# EAGLE design Adafruit Qualia S3 RGB666 (EAGLE 9.6.2)
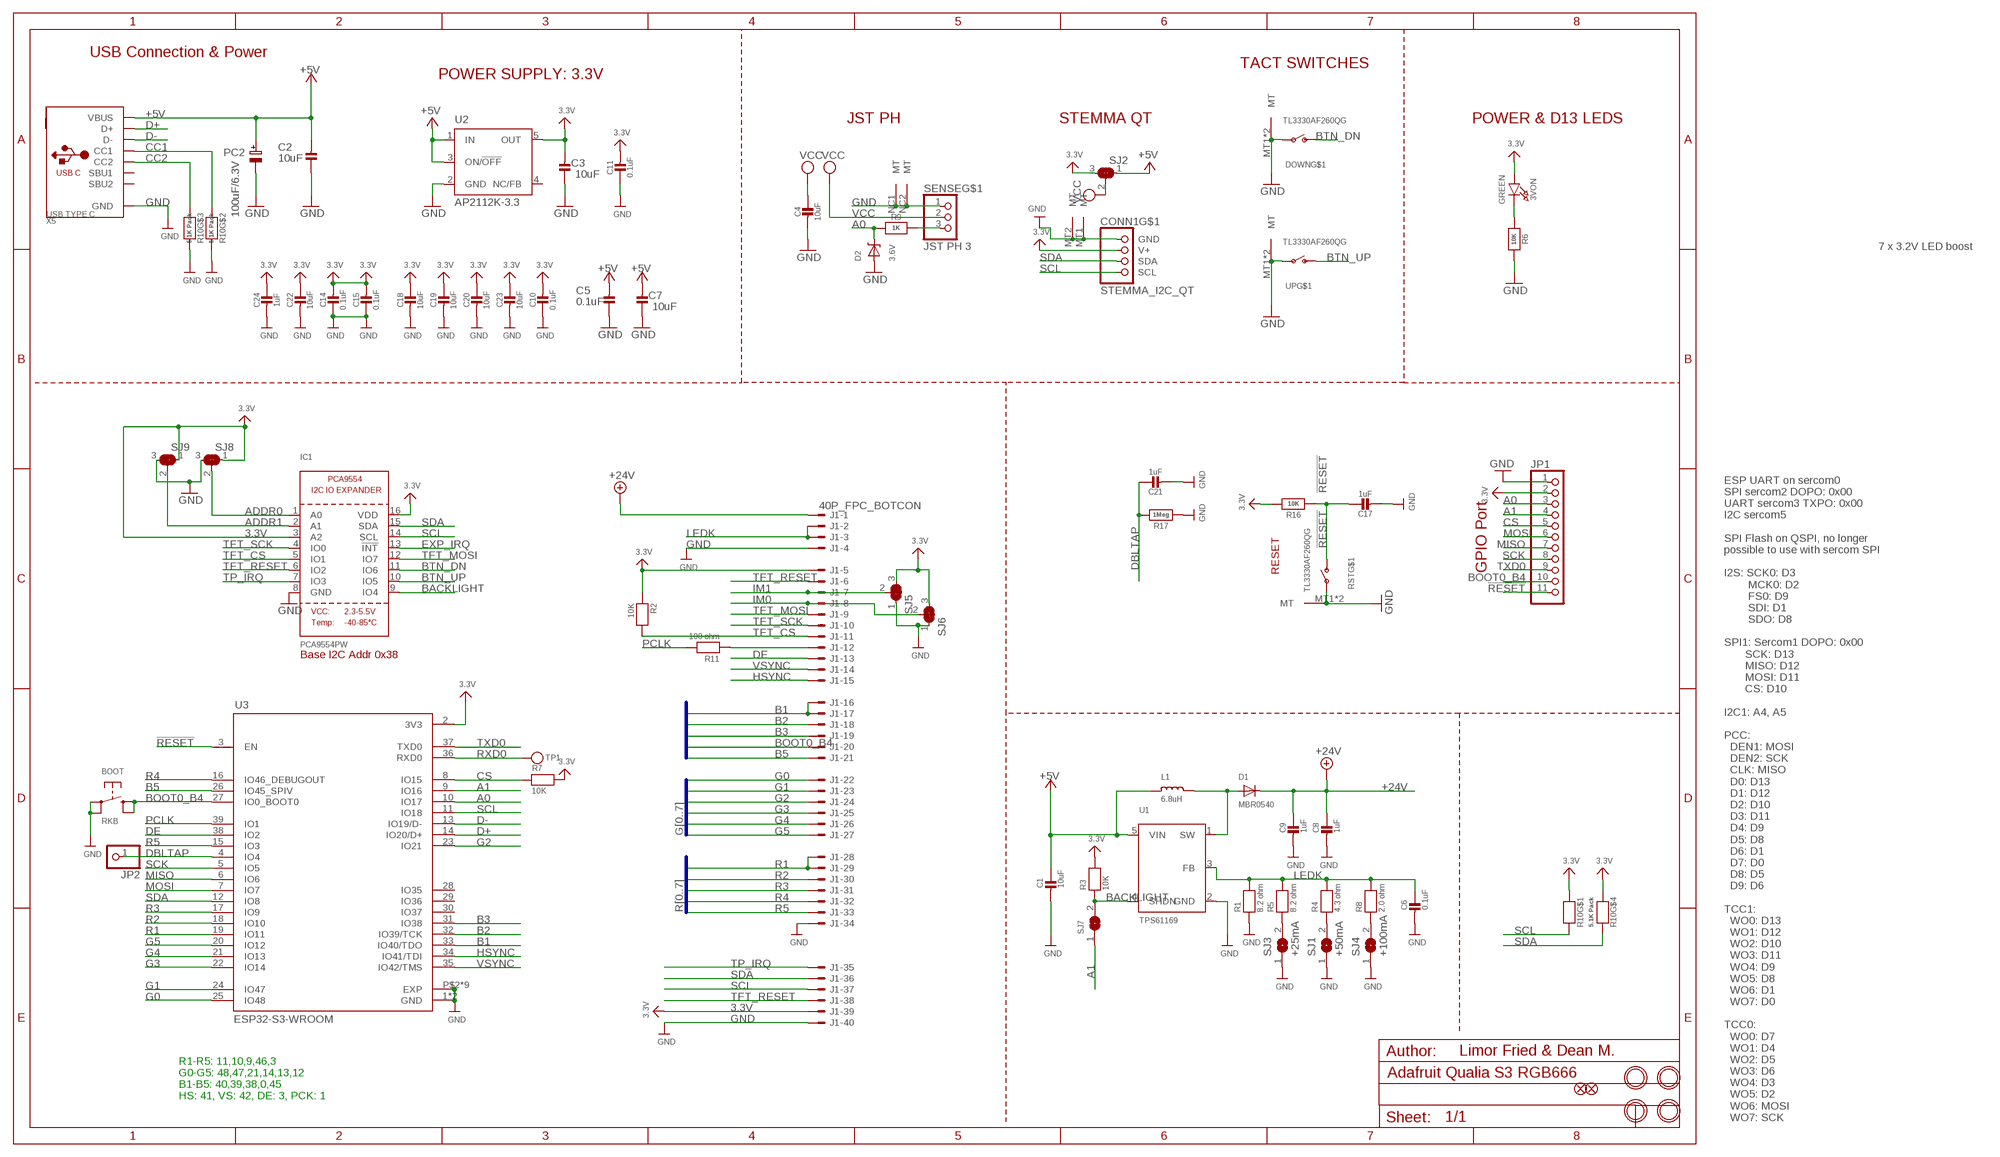
[diagram p0: schematic, sheet 1]

## Parts
3VON  GREEN  LED0603_NOOUTLINE  [CHIPLED_0603_NOOUTLINE]
BOOT  RKB  SWITCH_TACT_SMT_RKB2  [BTN_RKB2_4.6X2.8]
C1  10uF  CAP_CERAMIC0805-NOOUTLINE  [0805-NO]
C2  10uF  CAP_CERAMIC0805-NOOUTLINE  [0805-NO]
C3  10uF  CAP_CERAMIC0805-NOOUTLINE  [0805-NO]
C4  10uF  CAP_CERAMIC0805-NOOUTLINE  [0805-NO]
C5  0.1uF  CAP_CERAMIC0603_NO  [0603-NO]
C6  0.1uF  CAP_CERAMIC0603_NO  [0603-NO]
C7  10uF  CAP_CERAMIC0805-NOOUTLINE  [0805-NO]
C8  1uF  CAP_CERAMIC0603_NO  [0603-NO]
C9  1uF  CAP_CERAMIC0603_NO  [0603-NO]
C10  0.1uF  CAP_CERAMIC0603_NO  [0603-NO]
C11  0.1uF  CAP_CERAMIC0603_NO  [0603-NO]
C14  0.1uF  CAP_CERAMIC0603_NO  [0603-NO]
C15  0.1uF  CAP_CERAMIC0603_NO  [0603-NO]
C17  1uF  CAP_CERAMIC0603_NO  [0603-NO]
C18  10uF  CAP_CERAMIC0805-NOOUTLINE  [0805-NO]
C19  10uF  CAP_CERAMIC0805-NOOUTLINE  [0805-NO]
C20  10uF  CAP_CERAMIC0805-NOOUTLINE  [0805-NO]
C21  1uF  CAP_CERAMIC0603_NO  [0603-NO]
C22  10uF  CAP_CERAMIC0805-NOOUTLINE  [0805-NO]
C23  10uF  CAP_CERAMIC0805-NOOUTLINE  [0805-NO]
C24  1uF  CAP_CERAMIC0603_NO  [0603-NO]
CONN1  STEMMA_I2C_QT  [JST_SH4]
D1  MBR0540  DIODESOD-123  [SOD-123]
D2  3.6V  DIODE-ZENERSOD323  [SOD-323]
DOWN  TL3330AF260QG  SWITCH_SPST_MNT_TACT_RA  [SPST_TACTILE_RA]
FID1  FIDUCIAL_1MM  [FIDUCIAL_1MM]
FID2  FIDUCIAL_1MM  [FIDUCIAL_1MM]
IC1  PCA9554PW  [TSSOP16]
J1  40P_FPC_BOTCON  40PINFPC_GENERIC  [FPC_40]
JP1  HEADER-1X11  [1X11_ROUND]
JP2  HEADER-1X1ROUND  [1X01_ROUND]
L1  6.8uH  INDUCTORNR5040  [INDUCTOR_5X5MM_NR5040_NOTHERMALS]
PC2  100uF/6.3V  CAP_ELECTROLYTICPANASONIC_D  [PANASONIC_D]
R1  8.2 ohm  RESISTOR_0603_NOOUT  [0603-NO]
R2  10K  RESISTOR_0603_NOOUT  [0603-NO]
R3  10K  RESISTOR_0603_NOOUT  [0603-NO]
R4  4.3 ohm  RESISTOR_0603_NOOUT  [0603-NO]
R5  8.2 ohm  RESISTOR_0603_NOOUT  [0603-NO]
R6  10K  RESISTOR_0603_NOOUT  [0603-NO]
R7  10K  RESISTOR_0603_NOOUT  [0603-NO]
R8  2.0 ohm  RESISTOR_0603_NOOUT  [0603-NO]
R9  1K  RESISTOR_0603_NOOUT  [0603-NO]
R10  5.1K Pack  RESISTOR_4PACK  [RESPACK_4X0603]
R11  100 ohm  RESISTOR_0603_NOOUT  [0603-NO]
R16  10K  RESISTOR_0603_NOOUT  [0603-NO]
R17  1Meg  RESISTOR_0603_NOOUT  [0603-NO]
RST  TL3330AF260QG  SWITCH_SPST_MNT_TACT_RA  [SPST_TACTILE_RA]
SENSE  JST PH 3  CON_JST_PH_3PIN  [JSTPH3]
SJ1  +50mA  SOLDERJUMPER  [SOLDERJUMPER_ARROW_NOPASTE]
SJ2  SOLDERJUMPER_2WAY  [SOLDERJUMPER_2WAY_OPEN_NOPASTE]
SJ3  +25mA  SOLDERJUMPER  [SOLDERJUMPER_ARROW_NOPASTE]
SJ4  +100mA  SOLDERJUMPER  [SOLDERJUMPER_ARROW_NOPASTE]
SJ5  SOLDERJUMPER_2WAY  [SOLDERJUMPER_2WAY_OPEN_NOPASTE]
SJ6  SOLDERJUMPER_2WAY  [SOLDERJUMPER_2WAY_OPEN_NOPASTE]
SJ7  SOLDERJUMPER  [SOLDERJUMPER_ARROW_NOPASTE]
SJ8  SOLDERJUMPER_2WAY  [SOLDERJUMPER_2WAY_OPEN_NOPASTE]
SJ9  SOLDERJUMPER_2WAY  [SOLDERJUMPER_2WAY_OPEN_NOPASTE]
TP1  TESTPOINTROUND1.5MMNO  [TESTPOINT_ROUND_1.5MM_NO]
U1  TPS61169  VREG_BOOST_5PIN_SC70  [SC70-5]
U2  AP2112K-3.3  LP2985-XXDBVR33  [SOT23-DBV]
U3  ESP32-S3-WROOM  [S3-WROOM32]
U$14  MOUNTINGHOLE2.5  [MOUNTINGHOLE_2.5_PLATED]
U$19  MOUNTINGHOLE2.5  [MOUNTINGHOLE_2.5_PLATED]
U$22  MOUNTINGHOLE2.5  [MOUNTINGHOLE_2.5_PLATED]
U$24  MOUNTINGHOLE2.5  [MOUNTINGHOLE_2.5_PLATED]
UP  TL3330AF260QG  SWITCH_SPST_MNT_TACT_RA  [SPST_TACTILE_RA]
X5  USB TYPE C  USB_C  [USB_C_CUSB31-CFM2AX-01-X]

## Nets
3.3V: 3VON.A C3.2 C10.2 C11.2 C14.2 C15.2 C18.1 C19.1 C20.1 C22.1 C23.1 C24.1 CONN1.2(V+) IC1.3(A2) IC1.16(VDD) J1.5 J1.39 JP1.2 R2.1 R3.2 R7.2 R10.1 R10.4 R16.2 SJ2.3 SJ5.3 SJ6.3 SJ8.1 SJ9.1 U2.5(OUT) U3.2(3V3)
!RESET: C17.1 JP1.11 R16.1 RST.2(S) U3.3(EN)
+5V [usbvcc]: C1.1 C2.2 C5.2 C7.2 L1.P$1 PC2.+ SJ2.1 U1.5(VIN) U2.1(IN) U2.3(ON/!OFF) X5.A4B9(VBUS) X5.B4A9(VBUS)
+24V: C8.1 C9.1 D1.C J1.1
A0: D2.C JP1.3 R9.2 U3.10(IO17)
A0_JST: R9.1 SENSE.3
A1: JP1.4 SJ7.1 U3.9(IO16)
ADDR0: IC1.1(A0) SJ8.2
ADDR1: IC1.2(A1) SJ9.2
B1: J1.16 J1.17 U3.33(IO40/TDO)
B2: J1.18 U3.32(IO39/TCK)
B3: J1.19 U3.31(IO38)
B5: J1.21 U3.26(IO45_SPIV)
BACKLIGHT: IC1.9(IO4) R3.1 SJ7.2 U1.4(SHDN)
BOOT0_B4: BOOT.B'(S1) BOOT.B(S) J1.20 JP1.10 U3.27(IO0_BOOT0)
BTN_DN: DOWN.2(S) IC1.11(IO6)
BTN_UP: IC1.10(IO5) UP.2(S)
CC1: R10.2 X5.A5(CC1)
CC2: R10.3 X5.B5(CC2)
CS: JP1.5 R7.1 U3.8(IO15)
D+: U3.14(IO20/D+) X5.A6(D+) X5.B6(D+)
D-: U3.13(IO19/D-) X5.A7(D-) X5.B7(D-)
DBLTAP: C21.1 JP2.1 R17.2 U3.4(IO4)
DE: J1.13 U3.38(IO2)
EXP_IRQ: IC1.13(!INT)
G0: J1.22 U3.25(IO48)
G1: J1.23 U3.24(IO47)
G2: J1.24 U3.23(IO21)
G3: J1.25 U3.22(IO14)
G4: J1.26 U3.21(IO13)
G5: J1.27 U3.20(IO12)
GND [lowpower]: BOOT.A'(P1) BOOT.A(P) C1.2 C2.1 C3.1 C4.2 C5.1 C6.2 C7.1 C8.2 C9.2 C10.1 C11.1 C14.1 C15.1 C17.2 C18.2 C19.2 C20.2 C21.2 C22.2 C23.2 C24.2 CONN1.1(GND) CONN1.MT1(MT) CONN1.MT2(MT) D2.A DOWN.1(P) DOWN.MT1(MT) DOWN.MT2(MT) IC1.8(GND) J1.4 J1.34 J1.40 JP1.1 PC2.- R1.1 R6.2 R10.6 R10.7 R17.1 RST.1(P) RST.MT1(MT) RST.MT2(MT) SENSE.1 SENSE.NC1(MT) SENSE.NC2(MT) SJ1.1 SJ3.1 SJ4.1 SJ5.1 SJ6.1 SJ8.3 SJ9.3 U1.2(GND) U2.2(GND) U3.1(GND) U3.40(GND) U3.P$2(EXP) U3.P$3(EXP) U3.P$4(EXP) U3.P$5(EXP) U3.P$6(EXP) U3.P$7(EXP) U3.P$8(EXP) U3.P$9(EXP) U3.P$10(EXP) UP.1(P) UP.MT1(MT) UP.MT2(MT) X5.A1B12(GND) X5.B1A12(GND)
HSYNC: J1.15 U3.34(IO41/TDI)
IM0: J1.8 SJ6.2
IM1: J1.7 SJ5.2
LEDK: C6.1 J1.2 J1.3 R1.2 R4.2 R5.2 R8.2 U1.3(FB)
MISO: JP1.7 U3.6(IO6)
MOSI: JP1.6 U3.7(IO7)
N$2: 3VON.C R6.1
N$3: R4.1 SJ1.2
N$4: J1.12 R11.1
N$5: D1.A L1.P$2 U1.1(SW)
N$7: R5.1 SJ3.2
N$8: R8.1 SJ4.2
PCLK: R11.2 U3.39(IO1)
R1: J1.28 J1.29 U3.19(IO11)
R2: J1.30 U3.18(IO10)
R3: J1.31 U3.17(IO9)
R4: J1.32 U3.16(IO46_DEBUGOUT)
R5: J1.33 U3.15(IO3)
RXD0: TP1.P$1 U3.36(RXD0)
SCK: JP1.8 U3.5(IO5)
SCL: CONN1.4(SCL) IC1.14(SCL) J1.37 R10.8 U3.11(IO18)
SDA: CONN1.3(SDA) IC1.15(SDA) J1.36 R10.5 U3.12(IO8)
TFT_CS: IC1.5(IO1) J1.11 R2.2
TFT_MOSI: IC1.12(IO7) J1.9
TFT_RESET: IC1.6(IO2) J1.6 J1.38
TFT_SCK: IC1.4(IO0) J1.10
TP_IRQ: IC1.7(IO3) J1.35
TXD0: JP1.9 U3.37(TXD0)
VCC [power]: C4.1 SENSE.2 SJ2.2
VSYNC: J1.14 U3.35(IO42/TMS)
Unconnected: U2.4(NC/FB) U3.28(IO35) U3.29(IO36) U3.30(IO37) X5.A8(SBU1) X5.B8(SBU2)

## Buses
R[0..7]
G[0..7]
B[0..7],BOOT0_B4

## Notes on the sheet
- USB Connection & Power
- TACT SWITCHES
- POWER SUPPLY: 3.3V
- JST PH | STEMMA QT | POWER & D13 LEDS
- 7 x 3.2V LED boost
- RESET | GPIO Port
- Base I2C Addr 0x38
- Limor Fried & Dean M.
- R1-R5: 11,10,9,46,3
  G0-G5: 48,47,21,14,13,12
  B1-B5: 40,39,38,0,45
  HS: 41, VS: 42, DE: 3, PCK: 1
- ESP UART on sercom0
  SPI sercom2 DOPO: 0x00
  UART sercom3 TXPO: 0x00
  I2C sercom5
  
  SPI Flash on QSPI, no longer
  possible to use with sercom SPI
  
  I2S: SCK0: D3
          MCK0: D2
          FS0: D9
          SDI: D1
          SDO: D8
  
  SPI1: Sercom1 DOPO: 0x00
         SCK: D13
         MISO: D12
         MOSI: D11
         CS: D10
  
  I2C1: A4, A5
  
  PCC:
    DEN1: MOSI
    DEN2: SCK
    CLK: MISO
    D0: D13
    D1: D12
    D2: D10
    D3: D11
    D4: D9
    D5: D8
    D6: D1
    D7: D0
    D8: D5
    D9: D6
  
  TCC1:
    WO0: D13
    WO1: D12
    WO2: D10
    WO3: D11
    WO4: D9
    WO5: D8
    WO6: D1
    WO7: D0
  
  TCC0:
    WO0: D7
    WO1: D4
    WO2: D5
    WO3: D6
    WO4: D3
    WO5: D2
    WO6: MOSI
    WO7: SCK

## Library data of the parts
3VON = microbuilder:LED: LED 0603 - 0603 Surface Mount Package 2mA: Green LED - Low Power (3.9mcd, 2ma, 1.7Vf) - Digikey: 475-2709-2-ND Orange LED - Low Power (9.8mcd, 2ma, 1.8Vf) - Digikey: 475-1194-2-ND Red LED - Low Power (5mcd, 2ma, 1.8Vf) - Digikey: 475-1195-2-ND Yellow LED - Low Power (7mcd, 2ma, 1.8Vf) - Digikey: 475-1196-2-ND 5mA: Blue LED - Low Power (17mcd, 5ma, 2.9Vf) - Digikey: LNJ937W8CRACT-ND 0805 - 0805 Surface Mount Package 2mA: Red LED (8.8mcd, 2mA, 1.8Vf, Clear) - Low Power [Digikey: 475-2510-1-ND] Green LED (5mcd, 2mA, 1.8Vf, Clear) - Low Power [Digikey: 475-2730-1-ND] Yellow LED (11.3mcd, 2mA, 1.8Vf, Clear) - Low Power [Digikey: 475-2555-1-ND] 20mA: Red LED (104mcd, 20mA, Diffused) - LS R976 [Digikey: 475-1278-6-ND] Red LED (12mcd, 20mA, 2.0Vf, Clear) - APT2012EC [Digikey: 754-1128-1-ND] Green LED (15mcd, 20mA, 2.2Vf, Clear) - APT2012GC [Digikey: 754-1131-1-ND] Orange LED (160mcd, 20mA, 2.1Vf, Clear) - APT2012SECK [Digikey: 754-1130-1-ND] 1206 - 1206 Surface Mount Package Green LED (26mcd, 20mA, Diffused) - LG N971 [Digikey: 475-1407-6-ND] Red LED (15mcd, 20mA, Diffused) - LH N974 [Digikey: 475-1416-6-ND] Cree - Cree High-Power Surface Mount LEDs XPEBWT-L1-0000-00D50 - White 111lm 350mA 2.9Vf 6200K 110° XTEAWT-00-0000-00000LEE3 - White 114lm 350mA 2.85Vf 5000K 115° Everlight - Everlight 45-21 Series Surface Mount LEDs 45-21/QK2C-B2832AC2CB2/2T - Warm White 2000mcd 20mA 3.25Vf 3050K 120° 45-21/LK2C-B38452C4CB2/2T - Nuetral White 2000mcd 20mA 3.25Vf 4150K 120° 45-21/LK2C-B50634C6CB2/2T - Cold White 2200mcd 20mA 3.25Vf 5650K 120° PLCC2 Reverse Mount LS T77K-J1L2-1-0-2-R18-Z - Red 11.25mcd 2mA 1.8Vf 630nm 120° LO T77K-L1M2-24-Z - Orange 19.6mcd 2mA 1.8Vf 606nm 120° LY T77K-K2M1-26-Z - Yellow 15.7mcd 2mA 1.8Vf 587nm 120°; ROT: 270
BOOT = adafruit_electromech:SWITCH_TACT_SMT: SMT Tact Switches RKB2 https://www.digikey.com/short/m027prz5
C1-C11 C14 C15 C17-C24 = microbuilder:CAP_CERAMIC: Ceramic Capacitors For new designs, use the packages preceded by an '_' character since they are more reliable: The following footprints should be used on most boards: _0402 - Standard footprint for regular board layouts _0603 - Standard footprint for regular board layouts _0805 - Standard footprint for regular board layouts _1206 - Standard footprint for regular board layouts For extremely tight-pitch boards where space is at a premium, the following 'micro-pitch' footprints can be used (smaller pads, no silkscreen outline, etc.): _0402MP - Micro-pitch footprint for very dense/compact boards _0603MP - Micro-pitch footprint for very dense/compact boards _0805MP - Micro-pitch footprint for very dense/compact boards _1206MP - Micro-pitch footprint for very dense/compact boards
CONN1 = adafruit_electromech:STEMMA_I2C; LCSC: C2845363
D1 = microbuilder:DIODE: Diode SMA Model Volts Amps Type Vf Ir Digikey # Notes SSA34-E3 40V 3A Schottky 480mV @ 3A 200uA @ 40V SSA34-E3/61TGITR-ND CDBA120-G 20V 1A Schottky 500mV @ 1A 500uA @ 20V 641-1014-6-ND REEL MBRA210 10V 2A Schottky 350mV @ 2A 700uA @ 10V MBRA210LT3 SOD-123 Model Volts Amps Type Vf Ir Order # Notes BAT54T1G 30V 200mA Schottky 800mV @ 200mA 2uA @ 25V BAT54T1GOSTR-ND B0530W 30V 500mA Schottky 430mV @ 500mA 130uA @ 30V B0530W-FDICT-ND REEL MBR120 20V 1A Schottky 340mV @ 1A MBR120VLSFT1GOSCT-ND SOD-323 Model Volts Amps Type Vf Ir Order # Notes PMEG2005EJ 20V 500mA Schottky 355mV @ 500mA 568-4110-1-ND ZLLS410 10V 570mA Schottky 380mV @ 570mA ZLLS410CT-ND 1N4148WS 75V 150mA Silicon/Simple 1V 1N4148WSFSCT-ND REEL SOD-523 Model Volts Amps Type Vf Ir Order # Notes BAT54XV2 30V 200mA Schottky 0.8V @ 100mA BAT54XV2CT-ND TB751S 30V 30mA Schottky RB751S-40TE61CT-ND SOT23-R/W (R = Solder Paste/Reflow Ovens, W = Hand-Soldering) Model Volts Amps Type Vf Ir Order # Notes BAT54FILM 40V 300mA Schottky 497-7162-1-ND POWERDI-5 Model Volts Amps Type Vf Ir Order # Notes PDS560 60V 5A Schottky 670mV @ 5A 150uA @ 60V PDS560DICT-ND
D2 = microbuilder:DIODE-ZENER: Zener Diode SMA: 30V 1W Zener Diode, 1.2Vf - Digikey: SMAZ30-FDICT-ND
DOWN RST UP = adafruit_electromech:SWITCH_SPST_MNT: Switch - SPST 4UCon 19192 (6.7x2.6mm SMT); LCSC: C778159
FID1 FID2 = microbuilder:FIDUCIAL: Fiducial Alignment Points Various fiducial points for machine vision alignment.; BOM: EXCLUDE
IC1 = microbuilder:PCA9554
J1 = adafruit_display:40PINFPC: OMRON FPC Connector Source : http://www.omron.com/ecb/products/pdf/fpc.pdf XF2M-4015-rev is good for connecting up 'PSP' SHARP LQ043 LCDs
JP1 = microbuilder:HEADER-1X11
JP2 = microbuilder:HEADER-1X1: PIN HEADER
L1 = microbuilder:INDUCTOR: Inductors 0603: 10nH Ceramic Inductor - microwire antenna/RF (Digikey: 712-1434-2-ND) 0805: 560nH Ceramic Inductor - RF (Digikey: 553-1047-1-ND) 270nH Ceramic Inductor - Q = 40@250MHz, +-5%, 1 Ohm DC Resistance (Digikey: 535-10506-2-ND) 1007 (2518 Metric) SMT: 10µH 10% 250mOhm 820mA 1007 Inductor (Digikey: 587-2189-1-ND) 22µH 10% 500mOhm 580mA 1007 Inductor (Digikey: 587-2190-1-ND) 47µH 10% 950mOhm 420mA 1007 Inductor (Digikey: 587-2191-1-ND) 47µH 5% 100mOhm 1A 1008 Inductor (Digikey: 732-1816-1-ND) 5.0x5.0mm (Taiyo Yuden NR5040 Series) 6.8µH 20% 2.3A 64mOhm Inductor (Digikey: 587-2374-2-ND) 5.0x5.0mm (TDK VLC5045 Series) 4.7µH 20% 3.3A 34mOhm Inductor (Digikey: 445-6526-1-ND) 6.8µH 20% 2.7A 46mOhm Inductor (Digikey: 445-6527-1-ND) 6.0x6.0mm (TDK VLC6045 Series) 4.7µH 20% 3.8A 27mOhm Inductor (Digikey: 445-6538-2-ND) 6.8µH 20% 3A 41mOhm Inductor (Digikey: 445-6540-1-ND) 6.2µH 30% 2.2A 45mOhm Inductor (Digikey: SRR5028-6R2YCT-ND) - Not TDK VLC6045 but footprint should match 6.0x6.0mm (TDK SLF6045 Series) 6.8uH 30% 2A 33mOhm Inductor (Digikey: 445-4572-1-ND, Mouser: 810-SLF645T6R8N2R0PF) 6.0x6.0mm (Sumida CDRH5D28 Series) 6.2uH 30% 1.8A 45mOhm Inductor (Digikey: 308-1542-1-ND) Taiyo Yuden NR3015T2R2M - 2.2uH 20% 1.5A (Digikey: 587-1648-2-ND, Mouser: 963-NR3015T2R2M) - Used with TI TPS62172 CoilCraft RFID Transponder Coil - MA5532-AE (For use with AS3935 Lightning Sensor) Taiyo Yuden NRH2412T2R2MNGH - 2.2uH 20% 1AA (Digikey: 587-3443-1-ND) - Used with TI LM3671 Vishay IHLP 1.0uH Molded Inductor - 24mOhm DCR, 5A, +/-20%, -55°C-125°C (Digikey: 541-1319-1-ND)
PC2 = microbuilder:CAP_ELECTROLYTIC: Electrolytic Capacitors SMT PANASONIC_C - Size C Panasonic Electrolytic Aluminum Capacitor 47µF 16V 20% Electrolytic Capacitor [Digikey: PCE3890TR-ND] PANASONIC_D - Size D Panasonic Electrolytic Aluminum Capacitor 100µF 25V 20% Electrolytic Capacitor [Digikey: PCE3898TR-ND] PTH 3.5 mm grid, 8 mm diameter ... 3.5 mm grid, 10 mm diameter ...
R1-R9 R11 R16 R17 = microbuilder:RESISTOR: Resistors For new designs, use the packages preceded by an '_' character since they are more reliable: The following footprints should be used on most boards: _0402 - Standard footprint for regular board layouts _0603 - Standard footprint for regular board layouts _0805 - Standard footprint for regular board layouts _1206 - Standard footprint for regular board layouts For extremely tight-pitch boards where space is at a premium, the following 'micro-pitch' footprints can be used (smaller pads, no silkscreen outline, etc.): _0402MP - Micro-pitch footprint for very dense/compact boards _0603MP - Micro-pitch footprint for very dense/compact boards _0805MP - Micro-pitch footprint for very dense/compact boards _1206MP - Micro-pitch footprint for very dense/compact boards
R10 = microbuilder:RESISTOR_4PACK: Resistor Packs (4 resistors) 4 x 0603 10K 1/16W - Digikey: YC164J-10KCT-ND
SENSE = adafruit_electromech:CON_JST_PH_3PIN
SJ1 SJ3 SJ4 SJ7 = microbuilder:SOLDERJUMPER: SMD Solder JUMPER Solder the two pads together to create a connection, or remove the solder to break it. REFLOW - Use this footprint for solder paste and reflow ovens. WAVE - Use this footprint for hand-soldering (larger pads). CLOSED - Has a trace between the two pads to ensure it is closed by default. The trace needs to be cut to disable the jumper, and can be closed again by creating a solder bridge between the two pads.; BOM: EXCLUDE
SJ2 SJ5 SJ6 SJ8 SJ9 = microbuilder:SOLDERJUMPER_2WAY: 2-Way Solder Jumper
TP1 = microbuilder:TESTPOINT: Test Point Various test points for characterisation and PCB testing TESTPOINT_SMT - Compact Surface Mount Test Point [Digikey: 5016KTR-ND]
U1 = adafruit_power:VREG_BOOST_5PIN: FAN5331 - LED/OLED 20V Boost Converter Digikey: FAN5331SXCT-ND
U2 = SmartPrj:LP2985-XXDBVR: ULTRALOW-POWER 50-mA LOW-DROPOUT LINEAR REGULATORS 50-mA Low-Dropout Regulator Source: http://focus.ti.com/lit/ds/symlink/tps77001.pdf
U3 = adafruit_wireless:ESP32-S3-WROOM: WiFi 802.11b/g/n Transceiver Module 2.4GHz Antenna Not Included Surface Mount Check prices <https://snapeda.com/parts/ESP32-S2-WROVER/Espressif%20Systems/view-part/?ref=eda>
U$14 U$19 U$22 U$24 = adafruit_electromech:MOUNTINGHOLE: Mounting Hole For #2 screws (0.086"/2.18mm width, 0.094"/2.4mm hole) use 2.5mm; BOM: EXCLUDE
X5 = adafruit_electromech:USB_C: USB Type-C USB 2.0 Connector; LCSC: C165948

## Net classes
1 power: width 0.305 mm
2 lowpower: width 0.305 mm, drill 0.483 mm

## Board
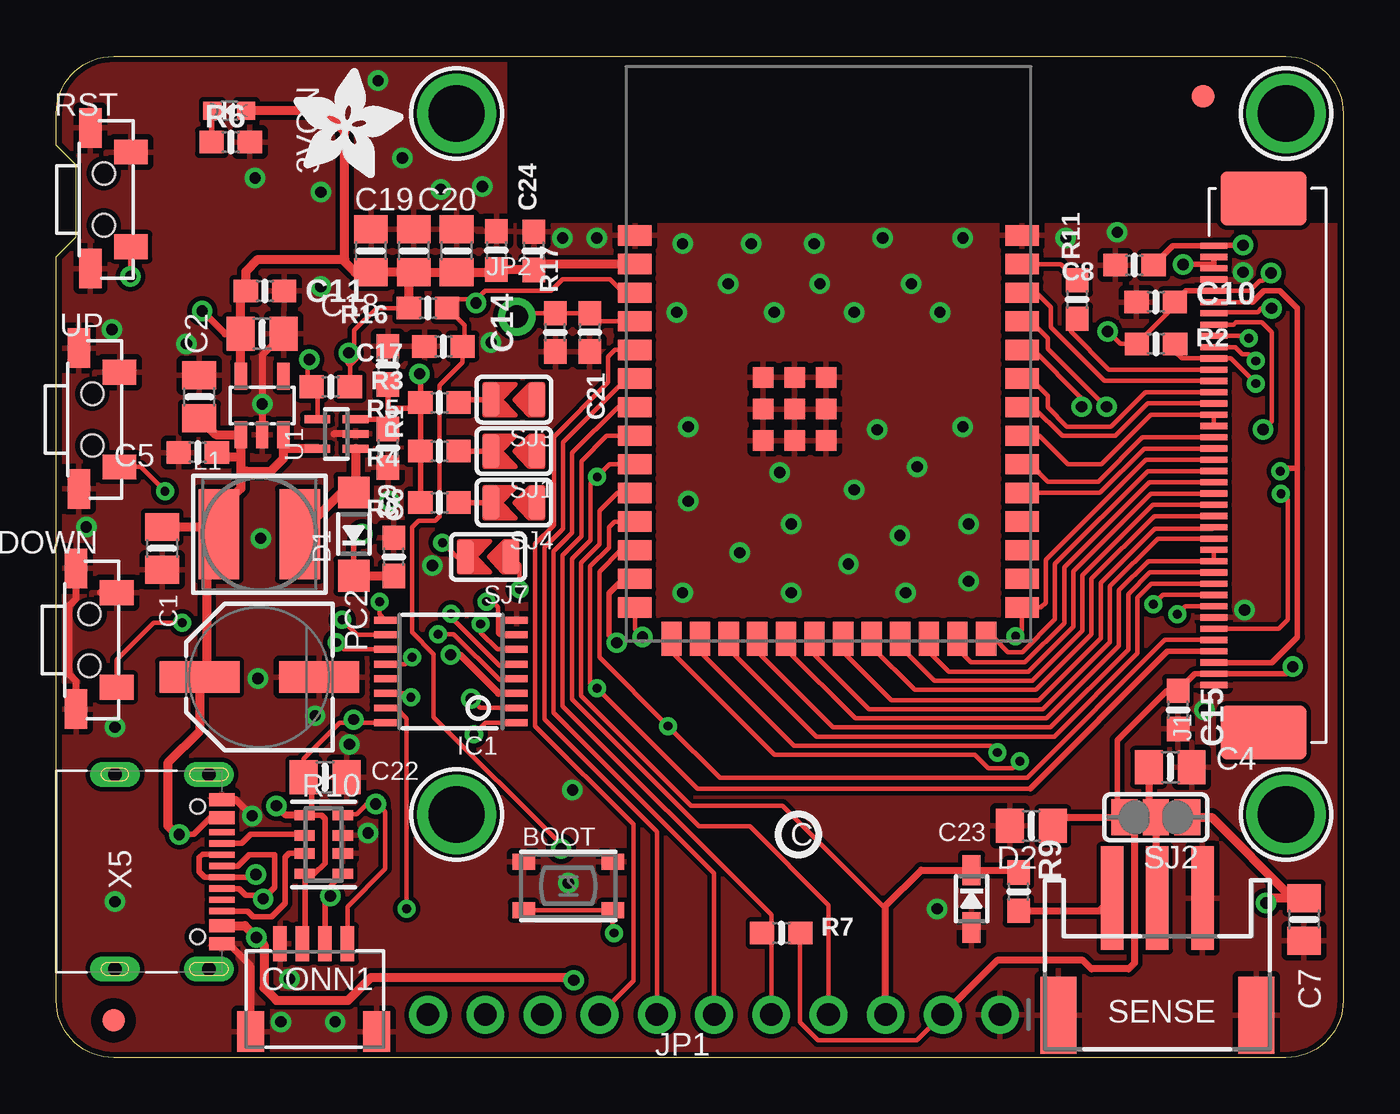
[diagram p1: board, top side]
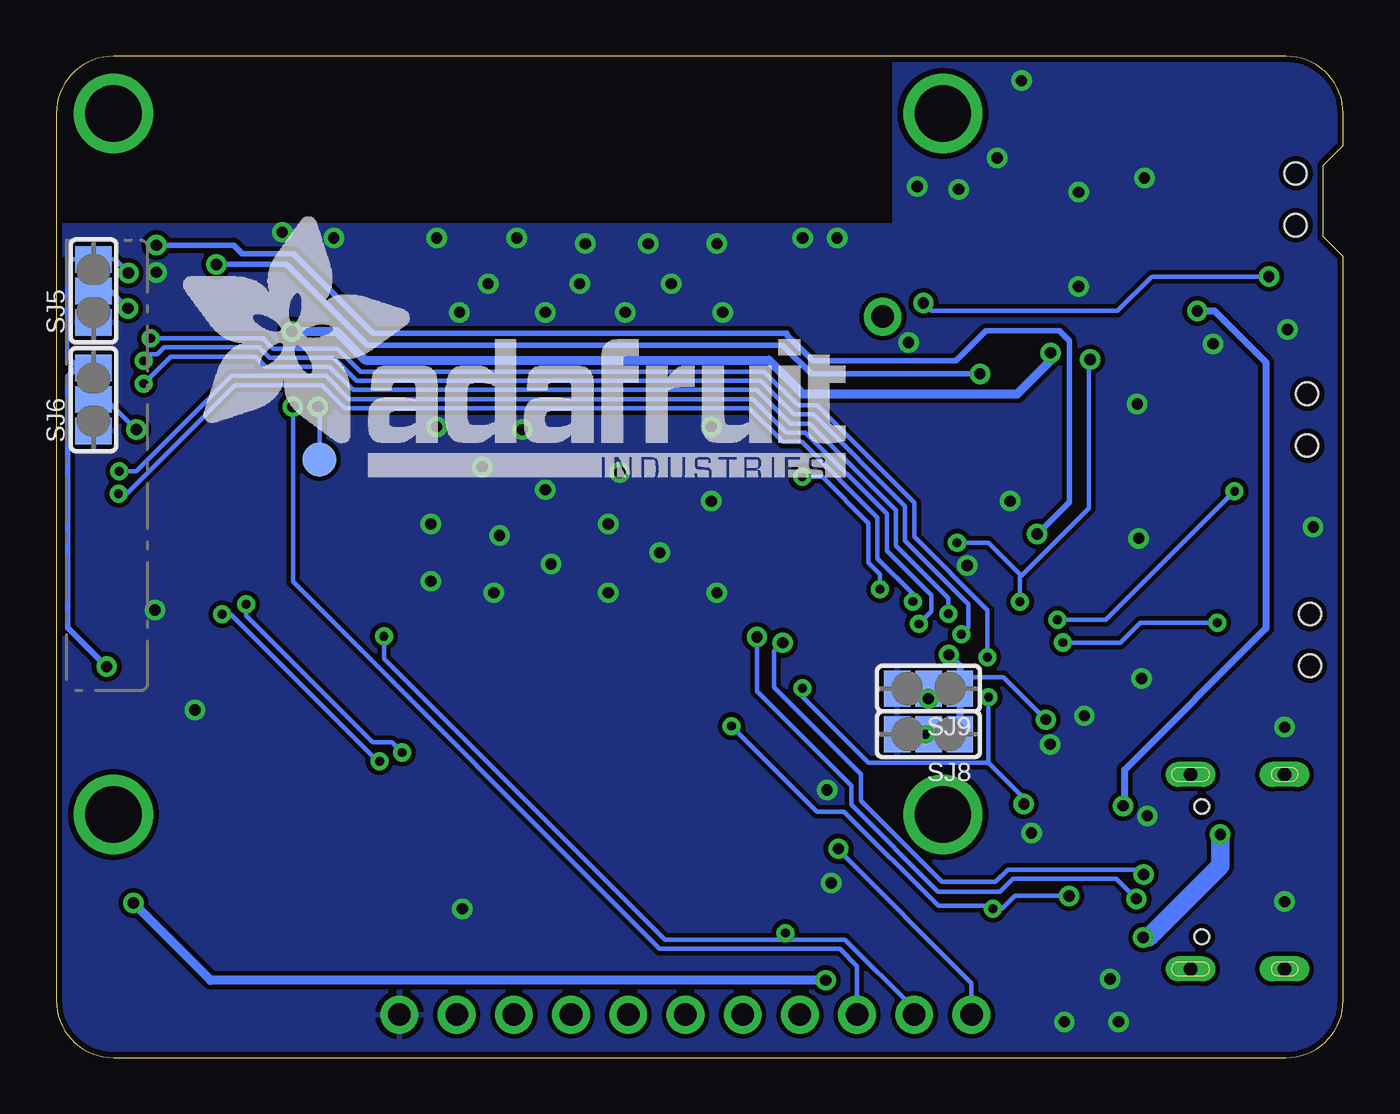
[diagram p2: board, bottom side, seen from below]

Size 57.15 x 44.45 mm. Coordinates in mm from the lower left corner, seen from the top.
Outline: 57.15,41.91 57.15,2.54 arc-90 54.61,0 2.54,0 arc-90 0,2.54 0,35.56 0.89,36.45 0.89,39.62 0,40.51 0,41.91 arc-90 2.54,44.45 54.61,44.45 arc-90 57.15,41.91
Copper layers (1*16): Top 0.035mm / dielectric 1.5mm / Bottom 0.035mm
Design rules "adafruit *": minimum track width 8mil, minimum drill 15.5mil, track to track 8mil, track to pad 8mil, pad to pad 8mil, via to via 8mil, smd to smd 8mil, copper to edge 10mil, drill to drill 8mil, minimum pad ring 10mil, minimum via ring 8mil, stop-mask expansion 2mil, vias tented up to drill 20mil, thermal gap 10mil

### Footprints (pad centres in the part's own frame; a part is rotated, then mirrored left to right if it is on the bottom)
CHIPLED_0603_NOOUTLINE = smd 0.8 x 0.8: A 0,-0.75; C 0,0.75
BTN_RKB2_4.6X2.8 = smd 1 x 0.7: A 1.973,1.075; A' -1.973,1.075; B 1.973,-1.075; B' -1.973,-1.075
0805-NO = smd 1.24 x 1.5: 1 -0.95,0; 2 0.95,0
0603-NO = smd 1.075 x 1: 1 -0.85,0; 2 0.85,0
JST_SH4 = smd 0.6 x 1.55: 1 -1.5,2.006; 2 -0.5,2.006; 3 0.5,2.006; 4 1.5,2.006 | smd 1.2 x 1.8: MT1 -2.8,-1.894; MT2 2.8,-1.894
SOD-123 = smd 1.4 x 1.4: A 1.85,0; C -1.85,0
SOD-323 = smd 1.35 x 0.8: A 1.27,0; C -1.27,0
SPST_TACTILE_RA = smd 1.1 x 1.5: 1 2.1,-0.9; 2 -2.1,-0.9 | smd 1.75 x 1: MT1 3.175,0.9; MT2 -3.075,0.9 | hole 1: 1.15,0.3; -1.15,0.3
FIDUCIAL_1MM = smd 1 x 1: 1 0,0
TSSOP16 = smd 0.305 x 0.991: 1 -2.275,-2.918; 2 -1.625,-2.918; 3 -0.975,-2.918; 4 -0.325,-2.918; 5 0.325,-2.918; 6 0.975,-2.918; 7 1.625,-2.918; 8 2.275,-2.918; 9 2.275,2.918; 10 1.625,2.918; 11 0.975,2.918; 12 0.325,2.918; 13 -0.325,2.918; 14 -0.975,2.918; 15 -1.625,2.918; 16 -2.275,2.918
FPC_40 = smd 0.275 x 1.2: 1 -9.75,-1.044; 2 -9.25,-1.044; 3 -8.75,-1.044; 4 -8.25,-1.044; 5 -7.75,-1.044; 6 -7.25,-1.044; 7 -6.75,-1.044; 8 -6.25,-1.044; 9 -5.75,-1.044; 10 -5.25,-1.044; 11 -4.75,-1.044; 12 -4.25,-1.044; 13 -3.75,-1.044; 14 -3.25,-1.044; 15 -2.75,-1.044; 16 -2.25,-1.044; 17 -1.75,-1.044; 18 -1.25,-1.044; 19 -0.75,-1.044; 20 -0.25,-1.044; 21 0.25,-1.044; 22 0.75,-1.044; 23 1.25,-1.044; 24 1.75,-1.044; 25 2.25,-1.044; 26 2.75,-1.044; 27 3.25,-1.044; 28 3.75,-1.044; 29 4.25,-1.044; 30 4.75,-1.044; 31 5.25,-1.044; 32 5.75,-1.044; 33 6.25,-1.044; 34 6.75,-1.044; 35 7.25,-1.044; 36 7.75,-1.044; 37 8.25,-1.044; 38 8.75,-1.044; 39 9.25,-1.044; 40 9.75,-1.044 | smd 2.4 x 3.81: PAD1 11.85,1.163; PAD2 -11.85,1.163
1X11_ROUND = drill 1 pad 1.676: 1 -12.7,0; 2 -10.16,0; 3 -7.62,0; 4 -5.08,0; 5 -2.54,0; 6 0,0; 7 2.54,0; 8 5.08,0; 9 7.62,0; 10 10.16,0; 11 12.7,0
1X01_ROUND = drill 1 pad 1.676: 1 0,0
INDUCTOR_5X5MM_NR5040_NOTHERMALS = smd 1.8 x 4: P$1 -1.8,0; P$2 1.8,0
PANASONIC_D = smd 3.556 x 1.4: + 2.654,0; - -2.654,0
RESPACK_4X0603 = smd 0.45 x 0.9: 1 -1.3,-0.85; 2 -0.4,-0.85; 3 0.4,-0.85; 4 1.3,-0.85; 5 1.3,0.85; 6 0.4,0.85; 7 -0.4,0.85; 8 -1.3,0.85
JSTPH3 = smd 1 x 4.6: 1 -2,-2.7; 2 0,-2.7; 3 2,-2.7 | smd 1.6 x 3.4: NC1 -4.4,2.5; NC2 4.4,2.5
SOLDERJUMPER_ARROW_NOPASTE = smd 0.762 x 1.524: 1 -1.016,0; 2 1.016,0
SOLDERJUMPER_2WAY_OPEN_NOPASTE = smd 1.168 x 1.6: 1 -1.397,0; 2 0,0; 3 1.397,0
TESTPOINT_ROUND_1.5MM_NO = smd 1.5 x 1.5: P$1 0,0
SC70-5 = smd 0.35 x 1.15: 1 -0.65,-0.85; 2 0,-0.85; 3 0.65,-0.85; 4 0.65,0.85; 5 -0.65,0.85
SOT23-DBV = smd 0.55 x 1.2: 1 -0.95,-1.3; 2 0,-1.3; 3 0.95,-1.3; 4 0.95,1.3; 5 -0.95,1.3
S3-WROOM32 = smd 1.5 x 0.9: 1 -8.6,9.064; 2 -8.6,7.794; 3 -8.6,6.524; 4 -8.6,5.254; 5 -8.6,3.984; 6 -8.6,2.714; 7 -8.6,1.444; 8 -8.6,0.174; 9 -8.6,-1.096; 10 -8.6,-2.366; 11 -8.6,-3.636; 12 -8.6,-4.906; 13 -8.6,-6.176; 14 -8.6,-7.446; 27 8.6,-7.446; 28 8.6,-6.176; 29 8.6,-4.906; 30 8.6,-3.636; 31 8.6,-2.366; 32 8.6,-1.096; 33 8.6,0.174; 34 8.6,1.444; 35 8.6,2.714; 36 8.6,3.984; 37 8.6,5.254; 38 8.6,6.524; 39 8.6,7.794; 40 8.6,9.064 | smd 0.9 x 1.5: 15 -6.97,-8.836; 16 -5.7,-8.836; 17 -4.43,-8.836; 18 -3.16,-8.836; 19 -1.89,-8.836; 20 -0.62,-8.836; 21 0.65,-8.836; 22 1.92,-8.836; 23 3.19,-8.836; 24 4.46,-8.836; 25 5.73,-8.836; 26 7,-8.836 | smd 0.9 x 0.9: P$2 -2.9,2.76; P$3 -2.9,1.36; P$4 -2.9,-0.04; P$5 -1.5,-0.04; P$6 -1.5,1.36; P$7 -1.5,2.76; P$8 -0.1,2.76; P$9 -0.1,1.36; P$10 -0.1,-0.04
MOUNTINGHOLE_2.5_PLATED = drill 2.5 pad 3.2: P$1 0,0
USB_C_CUSB31-CFM2AX-01-X = smd 0.575 x 1.15: A1B12 -3.2,2.275; A4B9 -2.4,2.275; B1A12 3.2,2.275; B4A9 2.4,2.275 | smd 0.275 x 1.15: A5 -1.25,2.275; A6 -0.25,2.275; A7 0.25,2.275; A8 1.25,2.275; B5 1.75,2.275; B6 0.75,2.275; B7 -0.75,2.275; B8 -1.75,2.275 | drill 0.6 pad 1 long: M1 -4.32,1.7; M2 4.32,1.7; M3 -4.32,-2.48; M4 4.32,-2.48 | hole 0.65: 2.89,1.2; -2.89,1.2

### Placement (x,y rotation side)
3VON  7.68,42.04 90 top
BOOT  22.73,7.62 0 top
C1  4.7,22.61 270 top
C2  6.35,29.34 270 top
C3  9.14,32.13 180 top
C4  49.47,12.89 0 top
C5  6.29,26.86 0 top
C6  14.73,27.05 270 top
C7  55.41,6.13 90 top
C8  47.88,35.18 180 top
C9  14.99,22.23 90 top
C10  48.82,33.54 0 top
C11  9.27,34.04 180 top
C14  19.54,35.84 270 top
C15  49.81,15.44 90 top
C17  17.2,31.57 180 top
C18  13.97,35.81 90 top
C19  15.88,35.81 90 top
C20  17.78,35.81 90 top
C21  23.69,32.19 270 top
C22  11.94,12.45 0 top
C23  43.31,10.29 180 top
C24  21.21,35.81 90 top
CONN1  11.43,3.05 0 top
D1  13.21,23.24 90 top
D2  40.64,7.05 270 top
DOWN  1.78,18.54 90 top
FID1  2.54,1.65 0 top
FID2  50.93,42.67 0 top
IC1  17.53,17.14 90 top
J1  52.45,26.29 270 top
JP1  29.21,1.91 180 top
JP2  20.45,32.89 0 top
L1  9.02,23.24 0 top
PC2  9.02,16.89 180 top
PLABEL0  [PLABEL0]  3.87,28.38 90 top
PLABEL1  [PLABEL1]  3.75,18.61 90 top
PLABEL2  [PLABEL2]  4.95,37.97 90 top
PLABEL3  [PLABEL3]  7.62,43.43 0 top
PLABEL4  [PLABEL4]  23.37,29.46 0 top
PLABEL5  [PLABEL5]  23.37,27.11 0 top
PLABEL6  [PLABEL6]  23.37,24.77 0 top
PLABEL7  [PLABEL7]  16.26,22.29 90 top
PLABEL8  [PLABEL8]  21.65,22.35 90 top
PLABEL9  [PLABEL9]  16.45,2.98 90 top
PLABEL10  [PLABEL10]  18.99,2.98 90 top
PLABEL11  [PLABEL11]  21.53,2.98 90 top
PLABEL12  [PLABEL12]  24.07,2.98 90 top
PLABEL13  [PLABEL13]  26.61,2.98 90 top
PLABEL14  [PLABEL14]  29.15,2.98 90 top
PLABEL15  [PLABEL15]  31.69,2.98 90 top
PLABEL16  [PLABEL16]  34.23,2.98 90 top
PLABEL17  [PLABEL17]  36.77,2.98 90 top
PLABEL18  [PLABEL18]  39.31,2.98 90 top
PLABEL19  [PLABEL19]  41.85,2.98 90 top
PLABEL20  [PLABEL20]  45.59,10.6 0 top
PLABEL21  [PLABEL21]  51.5,10.73 0 top
PLABEL22  [PLABEL22]  34.1,14.35 0 top
PLABEL23  [PLABEL23]  6.86,1.78 0 top
PLABEL24  [PLABEL24]  46.55,23.37 90 top
PLABEL25  [PLABEL25]  20.64,10.22 0 top
PLABEL26  [PLABEL26]  43.69,8.76 0 top
PLABEL27  [PLABEL27]  53.72,35.56 0 bottom
PLABEL28  [PLABEL28]  53.72,30.73 0 bottom
PLABEL29  [PLABEL29]  53.72,27.69 0 bottom
PLABEL30  [PLABEL30]  53.72,32.51 0 bottom
PLABEL31  [PLABEL31]  52.96,34.04 0 bottom
PLABEL32  [PLABEL32]  52.96,29.21 0 bottom
PLABEL33  [PLABEL33]  51.5,12 0 bottom
PLABEL34  [PLABEL34]  15.88,15.43 0 bottom
PLABEL35  [PLABEL35]  23.11,14.29 0 bottom
PLABEL36  [PLABEL36]  23.05,16.45 0 bottom
PLABEL37  [PLABEL37]  49.15,25.15 0 bottom
PLABEL38  [PLABEL38]  51.44,42.23 0 bottom
PLABEL39  [PLABEL39]  43.88,36.64 0 bottom
R1  14.73,30.73 270 top
R2  48.83,31.69 0 top
R3  12.19,29.78 0 top
R4  17.02,26.92 180 top
R5  17.02,29.08 180 top
R6  7.75,40.64 0 top
R7  32.19,5.52 0 top
R8  17.02,24.64 180 top
R9  42.74,7.37 90 top
R10  11.87,9.46 270 top
R11  45.34,33.66 90 top
R16  16.51,33.27 180 top
R17  22.16,32.19 90 top
RST  2.41,38.1 90 top
SENSE  48.9,4.38 180 top
SJ1  20.32,26.92 180 top
SJ2  48.83,10.67 180 top
SJ3  20.32,29.21 180 top
SJ4  20.32,24.64 180 top
SJ5  55.5,34.04 90 bottom
SJ6  55.5,29.21 90 bottom
SJ7  19.18,22.23 180 top
SJ8  18.41,14.35 180 bottom
SJ9  18.41,16.38 180 bottom
TP1  45.47,26.54 0 bottom
U1  12.45,27.69 90 top
U2  9.14,28.96 0 top
U3  34.29,27.43 0 top
U$14  17.78,10.79 0 top
U$19  17.78,41.91 0 top
U$22  54.61,41.91 0 top
U$24  54.61,10.79 0 top
U$44  [PCBFEAT-REV-040]  32.96,9.91 0 top
U$46  [ADAFRUIT_5MM]  10.54,39.05 0 top
U$49  [ADAFRUIT_TEXT_30MM]  51.75,25.78 0 bottom
UP  1.91,28.32 90 top
X5  5.08,8.26 270 top

### Tracks (layer width: path | path; a pad name or v marks a point on that pad's centre or on a via)
3.3V  (via drill 0.48, 0.5)
  Top 0.203: R3.2 13.04,30.86 | 13.23,31.05 13.23,32.28 14.22,33.27 R16.2 | J1.5 53.01,34.04 53.45,34.48 53.59,34.48 v53.94,34.83 | C10.2 49.67,33.38 R2.1 47.24,31.69 v46.69,32.24 | C22.1 10.99,13.27 12.58,14.87 13.21,14.87 | 13.21,14.87 IC1.16 | 13.21,14.87 v13.21,15.01 | R7.2 33.02,5.5 33.02,1.56 33.82,0.76 38.23,0.76 JP1.2
  Top 0.254: R10.4 11.06,8.13 | 11.06,8.13 11.06,6.86 11.06,5.18 CONN1.2 | R10.1 11.34,10.76 | 11.34,10.76 11.78,10.76 11.94,10.6 11.94,8.64 11.43,8.13 11.06,8.13 | 11.34,10.76 11.34,12.45 10.99,12.1 C22.1 | J1.5 50.17,34.04 C10.2 | v54.91,17.35 54.6,17.04 J1.39 50.56,17.04 C15.2 49.31,16.29 47.12,14.1 47.12,10.99 SJ2.3
  Top 0.305: C23.1 44.64,10.67 SJ2.3 47.88,10.22 47.88,4.19 47.62,3.94 45.97,3.94 45.59,4.32 41.78,4.32 JP1.2 | C3.2 7.49,32.13 v6.48,33.15 | R10.1 10.19,10.76 v9.78,11.18 | v17.51,17.88 17.93,17.88 19.63,16.17 IC1.3
  Top 0.406: C19.1 C18.1 13.27,34.86 12.81,35.32 12.81,35.43 | U2.5 C3.2 8.19,33.81 C11.2 8.42,34.9 8.95,35.43 12.81,35.43 | 12.81,35.43 12.81,41.1 11.88,42.04 3VON.A | R16.2 15.66,34.65 C19.1 | C19.1 C20.1 19.42,34.86 C14.2 21.18,34.99 C24.1 21.47,35.23 U3.2 | v13,31.29 12.93,31.22 13.17,30.99 | 13.23,31.05 13.17,30.99 | 13.17,30.99 13.04,30.86
  Bottom 0.203: SJ6.3 56.13,30.61 56.2,30.67 56.67,31.14 56.67,35.18 56.41,35.43 SJ5.3 54.54,35.43 v53.94,34.83 | v13.21,15.01 15.09,16.89 16.51,16.89 SJ9.1
  Bottom 0.254: v54.91,17.35 56.64,19.09 56.64,30.23 56.2,30.67
  Bottom 0.305: v6.48,33.15 5.71,33.15 3.43,30.86 3.43,19.05 9.7,12.78 9.7,11.26 v9.78,11.18 | v17.51,17.88 17.02,17.38 SJ9.1 SJ8.1
  Bottom 0.406: v46.69,32.24 44.71,32.24 43.43,30.96 25.5,30.96 24,29.46 14.48,29.46 13,30.94 v13,31.29
!RESET  (via drill 0.5)
  Top 0.203: U3.3 25.18,33.96 24.59,34.54 22.48,34.54 21.97,34.04 19.05,34.04 18.67,33.66 | 18.67,33.66 17.74,33.66 R16.1 18.12,32.51 18.12,31.65 C17.1 18.05,30.87 17.02,29.84 17.02,24 17,24 16.83,23.83 16.09,23.83 15.79,23.54 15.79,18.88 16.76,17.91 16.76,15.11 22.42,9.46 v22.42,9.27 | 18.67,33.66 18.64,33.63 v18.64,33.5
  Top 0.254: RST.2 3.31,34.68 v3.3,34.67
  Bottom 0.203: v3.3,34.67 8.51,34.67 10.03,33.15 18.29,33.15 v18.64,33.5 | v22.42,9.27 22.45,9.24 16.51,3.3 JP1.11
+5V  (via drill 0.5)
  Top 0.254: X5.A4B9 6.83,10.65 6.45,10.28 6.45,10.26 6.1,9.91 v5.46,9.91
  Top 0.406: C2.2 7.08,27.66 U2.1 8.19,26.67 | 8.19,26.67 8.19,25.78 | 8.19,25.78 8.19,25.27 6.67,23.75 6.67,23.24 | 6.67,23.24 6.67,17.2 PC2.+ 6.36,14.49 4.95,13.08 4.95,10.29 5.33,9.91 v5.46,9.91 | 8.19,25.78 8.45,26.04 9.53,26.04 10.09,26.6 10.09,27.18 | 10.09,27.18 U2.3 | X5.B4A9 8.37,5.86 v8.89,5.33 9.22,5 9.22,3.1 9.78,2.54 12.95,2.54 13.97,3.56 22.86,3.56 v22.99,3.43 | C1.1 6.9,23.56 L1.P$1 6.67,23.24 | C5.2 7.33,26.67 8.19,26.67 | U1.5 10.24,27.04 10.09,27.18 | SJ2.1 51.31,10.67 54.89,7.08 C7.2 53.95,7.08 v53.72,6.86
  Bottom 0.406: v22.99,3.43 50.3,3.43 v53.72,6.86
  Bottom 0.813: v8.89,5.33 8.64,5.33 5.46,8.51 v5.46,9.91
+24V  (via drill 0.5)
  Top 0.254: C8.1 49.59,36.04 J1.1 51.44,36.07 v52.7,36.07 | v13.59,23.24 13.21,22.86 D1.C
  Top 0.406: D1.C 14.97,21.39 C9.1
  Bottom 0.254: v52.7,36.07 49.27,36.07 48.89,35.69 46.61,35.69 43.07,32.15 24.7,32.15 24.7,32.07 23.55,30.93 17.2,30.93 15.87,32.26 12.61,32.26 12.17,31.82 12.17,24.66 v13.59,23.24
A0
  Top 0.203: JP1.3 36.83,6.6 32.26,11.18 28.19,11.18 23.3,16.07 23.3,21.97 24.13,22.8 24.13,24.27 24.93,25.07 U3.10
  Top 0.305: R9.2 42.63,8.32 D2.C 38.42,8.32 36.83,6.73 JP1.3
A0_JST
  Top 0.305: R9.1 46.33,6.52 SENSE.3
A1  (via drill 0.39)
  Top 0.203: U3.9 24.57,26.34 24.02,25.79 | 24.02,25.79 23.72,25.49 23.72,22.97 22.9,22.14 22.9,15.9 28.53,10.26 30.8,10.26 34.29,6.77 JP1.4 | SJ7.1 20.57,21.85 v20.57,20.79 | v24.02,25.78 24.02,25.79
  Bottom 0.203: v20.57,20.79 20.57,21.45 21.08,21.97 21.08,23.73 23.13,25.78 v24.02,25.78
ADDR0  (via drill 0.39)
  Top 0.203: IC1.1 19.06,14.87 v18.54,14.35
  Bottom 0.203: SJ8.2 v18.54,14.35
ADDR1  (via drill 0.48)
  Top 0.203: IC1.2 18.82,15.52 v18.41,15.93
  Bottom 0.203: SJ9.2 18.8,16.38 18.8,16.31 v18.41,15.93
B1
  Top 0.203: U3.33 43.65,27.61 44.92,26.34 46.4,26.34 48.6,28.54 J1.16 J1.17
B2
  Top 0.203: J1.18 48.24,27.54 46.27,25.57 44.03,25.57 43.27,26.34 U3.32
B3
  Top 0.203: J1.19 48.31,27.04 46.34,25.07 U3.31
B5
  Top 0.203: J1.21 48.46,26.04 44.35,21.93 44.35,19.46 42.89,18 42.27,18 41.67,18.6 U3.26
BACKLIGHT  (via drill 0.39, 0.4, 0.5)
  Top 0.203: U1.4 11.6,29.53 R3.1 11.15,29.97 11.15,30.9 v11.24,30.99 | SJ7.2 17.78,22.23 v17.14,22.86 | IC1.9 14.35,19.68 v14.35,20.23
  Bottom 0.203: v17.14,22.86 15.75,22.86 14.29,21.4 | 14.29,21.4 14.35,21.34 v14.35,20.23 | 14.29,21.4 11.3,24.38 11.3,30.92 v11.24,30.99
BOOT0_B4  (via drill 0.39)
  Top 0.203: J1.20 48.39,26.54 43.95,22.09 43.95,20.2 43.73,19.99 U3.27 42.89,19 v42.6,18.71 | BOOT.B' BOOT.B 24.71,5.59 v24.77,5.53
  Bottom 0.203: v42.6,18.71 42.6,17.72 30.12,5.23 25.06,5.23 | 25.06,5.23 22.12,5.23 19.05,2.16 JP1.10 | v24.77,5.53 25.06,5.23
BTN_DN  (via drill 0.39)
  Top 0.203: DOWN.2 2.68,17.66 4.32,19.3 v5.59,19.3 | v12.45,18.43 12.75,18.12 IC1.11
  Bottom 0.203: v5.59,19.3 9.02,19.3 9.91,18.41 12.43,18.41 v12.45,18.43
BTN_UP  (via drill 0.39)
  Top 0.203: IC1.10 13.36,18.77 v12.7,19.43 | UP.2 3.75,26.22 v4.83,25.15
  Bottom 0.203: v12.7,19.43 10.54,19.43 v4.83,25.15
CC1
  Top 0.254: X5.A5 8.23,9.51 8.64,9.91 10.98,9.91 R10.2
CC2
  Top 0.254: X5.B5 8.5,6.5 8.75,6.25 9.55,6.25 10.16,6.86 10.16,8.89 10.33,9.06 R10.3
CS
  Top 0.203: JP1.5 31.75,5.29 31.75,5.93 | 31.75,5.93 31.75,6.34 22.49,15.6 22.49,22.31 23.32,23.14 23.32,26.48 24.44,27.61 U3.8 | R7.1 31.75,5.93
D+  (via drill 0.5)
  Top 0.203: U3.14 25.69,19.01 v26.04,18.67
  Top 0.254: X5.A6 8.05,8.51 8.56,9.01 9.69,9.01 9.69,7.56 v9.19,7.05 9.02,7.22 8.4,7.22 8.12,7.5 X5.B6
  Bottom 0.203: v26.04,18.67 26.04,16.26 21.84,12.06 21.84,11.21 18,7.37 15.24,7.37 14.67,7.94 10.07,7.94 v9.19,7.05
D-  (via drill 0.5)
  Top 0.254: v8.87,8.13 8.75,8.01 X5.A7 7.35,8.01 6.59,8.01 6.35,8.26 6.35,8.89 6.5,9.04 7.39,9.04 X5.B7 | U3.13 25.18,21.26 24.55,20.62 24.55,18.76 v24.89,18.41
  Bottom 0.203: v24.89,18.41 25.27,18.03 25.27,16.43 21.41,12.57 21.41,11.39 17.82,7.8 15.44,7.8 14.9,8.34 9.09,8.34 v8.87,8.13
DBLTAP
  Top 0.203: U3.4 23.69,32.69 C21.1 R17.2 20.6,33.04 JP2.1
DE
  Top 0.203: J1.13 46.54,30.04 44.16,32.42 44.16,33.32 43.52,33.96 U3.38
G0
  Top 0.203: U3.25 40.02,18.15 40.62,17.54 43.01,17.54 44.76,19.29 44.76,21.76 48.54,25.54 J1.22
G1
  Top 0.203: J1.23 48.61,25.04 45.16,21.59 45.16,19.12 43.18,17.14 39.63,17.14 38.75,18.02 U3.24
G2
  Top 0.203: J1.24 48.69,24.54 45.57,21.42 45.57,18.95 43.34,16.73 38.99,16.73 37.48,18.23 U3.23
G3
  Top 0.203: U3.22 36.21,18.23 38.12,16.32 43.51,16.32 45.98,18.79 45.98,21.25 48.76,24.04 J1.25
G4
  Top 0.203: J1.26 51.35,23.48 48.78,23.48 46.38,21.08 46.38,18.62 43.64,15.88 37.08,15.88 35.07,17.89 35.07,18.47 U3.21
G5
  Top 0.203: J1.27 48.91,23.04 46.79,20.92 46.79,18.45 43.81,15.47 36.09,15.47 33.67,17.89 U3.20
GND  (via drill 0.5)
  Top 0.305: v8.7,10.73 7.98,11.46 X5.A1B12 | C3.1 9.14,31.18 U2.2 | CONN1.MT1 8.63,4.07 7.64,5.05 | DOWN.MT2 0.88,16.71 0.57,17.02 0.57,20.07 0.88,20.37 DOWN.MT1 | 1.95,20.64 DOWN.1 | U1.2 12.32,27.69
  Top 0.406: X5.B1A12 7.64,5.05
  other vias: 9.08,23.05 11.75,34.23 9.14,29.02 17.08,38.54 8.83,39.05 11.75,38.42 14.29,43.37 5.78,31.69 2.48,32.32 1.33,23.56 2.6,14.67 13.84,9.97 10.35,3.49 12.38,1.59 2.6,6.92 9.97,1.59 19.3,31.75 52.77,19.88 50.99,15.43 52.7,34.86 44.83,36.39 47.12,36.64 40.26,36.39 36.7,36.39 33.66,36.13 30.86,36.13 27.81,36.13 27.56,33.08 31.88,33.08 35.43,33.08 39.24,33.08 37.97,34.35 33.91,34.35 29.84,34.35 28.07,28 28.07,24.7 32.64,23.69 35.43,25.21 36.45,27.88 40.26,28 38.23,26.23 40.51,23.69 37.47,23.18 40.51,21.15 37.72,20.64 35.18,21.91 32.64,20.64 30.35,22.42 27.81,20.64 32.13,25.97 24,36.39 22.48,36.39 18.92,38.67 15.37,39.94 14.8,24.7 22.92,11.87 13.02,13.91 11.49,15.18 8.95,16.83 16.7,21.84 22.73,7.75 39.12,6.6
  pour Top: 19.94,44.45 19.94,36.96 57.15,36.96 57.15,0 0,0 0,44.45
  pour Bottom: 19.94,44.45 19.94,36.96 57.15,36.96 57.15,0 0,0 0,44.45
HSYNC
  Top 0.203: U3.34 43.4,28.88 44.67,27.61 47.04,27.61 48.47,29.04 J1.15
IM0  (via drill 0.5)
  Top 0.203: J1.8 52.3,32.54 52.39,32.63 53.53,32.63 53.97,32.19 53.97,28.26 v53.59,27.88
  Bottom 0.203: v53.59,27.88 54.92,29.21 SJ6.2
IM1  (via drill 0.5)
  Top 0.203: J1.7 51.47,33.1 53.35,33.1 53.52,33.26 v53.97,33.26
  Bottom 0.203: v53.97,33.26 54.74,34.04 SJ5.2
LEDK  (via drill 0.5)
  Top 0.254: R8.2 R4.2 R5.2 | 14.73,28.83 C6.1 14.3,28.34 U1.3 | 14.73,28.83 R1.2 | R5.2 15.91,28.83 14.73,28.83 | J1.2 J1.3 51.41,35.21 v50.04,35.21 | v16.13,30.35 16.17,30.31 R5.2
  Bottom 0.254: v16.13,30.35 23.62,30.35 24.89,31.62 43.33,31.62 46.92,35.21 v50.04,35.21
MISO
  Top 0.203: U3.6 25.33,30.15 22.5,27.32 22.5,23.47 21.68,22.64 21.68,15.01 26.67,10.02 JP1.7
MOSI
  Top 0.203: U3.7 24.94,28.88 22.91,26.85 22.91,23.3 22.08,22.48 22.08,15.31 29.21,8.18 JP1.6
N$1
  Top 0.203: 49.28,10.67 49.78,10.67
N$2
  Top 0.254: 3VON.C 6.9,42.04 R6.1
N$3
  Top 0.254: R4.1 SJ1.2
N$4
  Top 0.203: R11.1 45.05,32.51 45.05,32.24 46.74,30.54 J1.12
N$5
  Top 0.406: L1.P$2 12.67,25.09 13.08,25.09 | 13.08,25.09 D1.A | U1.1 13.3,25.31 13.08,25.09
N$6
  Bottom 0.203: 55.5,34.92 55.5,34.54
N$7
  Top 0.254: R5.1 18,29.21 SJ3.2
N$8
  Top 0.254: R8.1 SJ4.2
N$9
  Bottom 0.203: 55.5,30.1 55.5,29.72
N$10
  Bottom 0.203: 17.46,16.45 17.84,16.45
N$11
  Bottom 0.203: 17.53,14.22 17.84,14.22
PCLK
  Top 0.203: U3.39 44.62,35.23 R11.2
R1
  Top 0.203: J1.28 J1.29 48.49,22.04 47.2,20.75 47.2,18.28 43.98,15.06 35.48,15.06 32.38,18.16 32.38,18.58 U3.19
R2
  Top 0.203: J1.30 48.56,21.54 47.6,20.58 47.6,18.11 44.15,14.66 34.49,14.66 31.11,18.03 31.11,18.58 U3.18
R3
  Top 0.203: J1.31 48.64,21.04 48.01,20.41 48.01,17.94 44.31,14.25 33.76,14.25 29.84,18.16 29.84,18.58 U3.17
R4  (via drill 0.39)
  Top 0.203: J1.32 49.13,20.54 v48.71,20.12 | v41.8,13.54 41.5,13.84 32.77,13.84 28.59,18.02 U3.16
  Bottom 0.203: v48.71,20.12 48.71,19.61 43.1,13.99 42.25,13.99 v41.8,13.54
R5  (via drill 0.39)
  Top 0.203: J1.33 50.14,20.04 v49.78,19.68 | U3.15 27.32,18.02 31.9,13.44 40.79,13.44 41.39,12.84 42.48,12.84 v42.8,13.16
  Bottom 0.203: v42.8,13.16 42.88,13.16 49.4,19.68 v49.78,19.68
RXD0  (via drill 0.5)
  Top 0.203: U3.36 43.39,31.42 45.53,29.27 v45.53,28.89
  Bottom 0.203: v45.53,28.89 45.53,28.64 45.47,28.57 TP1.P$1
SCK
  Top 0.203: JP1.8 25.63,3.4 25.63,10.36 21.27,14.72 21.27,22.81 22.1,23.64 22.1,27.56 24.51,29.97 24.51,31.11 24.81,31.42 U3.5
SCL  (via drill 0.39, 0.5)
  Top 0.203: 12.76,10.79 13.34,10.79 13.8,11.26 v14.18,11.26 14.27,11.26 14.61,10.92 14.61,8.38 12.93,6.71 CONN1.4 | 43.25,11.94 28.48,11.94 v24.02,16.4 23.89,16.4 23.71,16.59 23.71,21.8 24.55,22.64 24.55,23.54 24.8,23.8 U3.11 | IC1.14 15.58,16.17 v15.75,16
  Top 0.254: R10.8 12.76,10.79 | 43.25,11.94 49.35,18.04 J1.37
  Bottom 0.203: v14.18,11.26 14.18,11.52 15.75,13.08 | 15.75,13.08 v15.75,16 | 15.75,13.08 21.08,13.08 24.02,16.02 v24.02,16.4
SDA  (via drill 0.39, 0.5)
  Top 0.203: J1.36 49.24,18.54 43.12,12.42 29.46,12.42 v27.17,14.72 24.11,17.77 24.11,21.57 25.07,22.53 U3.12 | 11.87,7.31 12,7.31 12.04,7.31 v12.17,7.18 | IC1.15 15.09,15.52 15.56,15.05 v15.56,6.61
  Top 0.254: CONN1.3 11.93,7.24 12,7.31 | 11.87,7.31 R10.5
  Bottom 0.203: v12.17,7.18 14.58,7.18 15.15,6.61 v15.56,6.61 15.68,6.74 17.97,6.74 22.16,10.92 23.37,10.92 v27.17,14.72
TFT_CS  (via drill 0.39)
  Top 0.203: R2.2 49.68,31.34 49.99,31.04 J1.11 52.16,31.04 v53.27,29.93 v53.27,29.92 | v17.54,19.7 17.54,19.55 19.68,17.4 20.37,17.4 IC1.5
  Bottom 0.203: v53.27,29.92 52.07,31.12 48.3,31.12 47.85,30.67 45,30.67 43.98,29.64 26.05,29.64 24.55,28.14 23.7,28.14 19.86,24.3 19.86,22.72 17.54,20.39 v17.54,19.7
TFT_MOSI  (via drill 0.39)
  Top 0.203: J1.9 52.85,32.04 v52.96,31.93 | v15.8,17.78 15.49,17.47 IC1.12
  Bottom 0.203: v52.96,31.93 47.97,31.93 47.52,31.48 44.67,31.48 43.64,30.45 25.71,30.45 24.21,28.96 23.37,28.96 19.05,24.64 19.05,23.11 15.8,19.87 v15.8,17.78
TFT_RESET  (via drill 0.39)
  Top 0.203: J1.6 53.12,33.54 | v18.85,19.25 18.85,18.87 19.6,18.12 IC1.6
  Top 0.254: J1.38 53.99,17.54 55.12,18.67 55.12,26.16 | 55.12,26.16 55.12,33.27 54.34,34.05 53.63,34.05 53.12,33.54 | 55.12,26.16 54.48,26.16 v54.36,26.04
  Bottom 0.203: v54.36,26.04 53.59,26.04 49.37,30.26 45.17,30.26 44.15,29.23 26.22,29.23 24.72,27.74 23.87,27.74 20.27,24.13 20.27,22.51 18.28,20.52 18.28,19.82 v18.85,19.25
TFT_SCK  (via drill 0.39)
  Top 0.203: J1.10 52.35,31.54 52.67,31.23 52.97,31.23 v53.27,30.93 | IC1.4 20.39,16.76 19.68,16.76 17.65,18.8 v16.95,18.8
  Bottom 0.203: v53.27,30.93 52.97,31.23 52.67,31.23 52.37,31.52 48.13,31.52 47.68,31.07 44.84,31.07 43.81,30.05 25.88,30.05 24.38,28.55 23.54,28.55 19.46,24.47 19.46,22.95 16.64,20.13 16.64,19.11 v16.95,18.8
TP_IRQ  (via drill 0.39)
  Top 0.203: J1.35 54.29,19.04 54.69,19.43 54.69,24.77 54.42,25.03 v54.39,25.03 | IC1.7 19.69,18.77 19.61,18.85 19.61,19.99 19.36,20.25 v19.11,20.25
  Bottom 0.203: v54.39,25.03 54.02,25.03 49.2,29.85 45.34,29.85 44.32,28.83 26.39,28.83 24.89,27.33 24.04,27.33 20.68,23.96 20.68,22.15 19.11,20.58 v19.11,20.25
TXD0  (via drill 0.5)
  Top 0.203: U3.37 43.27,32.69 44.03,31.92 44.03,31.46 46.6,28.89 v46.64,28.89
  Bottom 0.203: v46.64,28.89 46.64,21.11 30.35,4.83 22.35,4.83 21.59,4.06 JP1.9
VCC
  Top 0.305: C4.1 48.52,10.98 SJ2.2 48.83,7.14 SENSE.2
VSYNC
  Top 0.203: J1.14 48.36,29.54 46.84,28.02 44.88,28.02 44.03,28.86 44.03,29.38 43.27,30.15 U3.35

### Text on the board
Pinguin_tBackup: On | Reset | UP | +25 | +50 | 100 | RGB-666 TFT w/ / opt Cap. Touch | PWM | A1 | DN | Qualia ESP32-S3 / RGB666 40p TFT | 3 | 5 | Boot0 | A0 | Reset | Boot0 | TX0 | SCK | MISO | MOSI | CS | A1 | A0 | 3.3V | GND | I2C / QT
Pinguin_bBackup: Qualia S3 RGB666 | Dotclock TFT Display / Experimentation Board | H | IM1 | L | H | IM0 | L | RXD0 | A1 | PCA9554 default / I2C addr 0x3F | A0 | 16-Bit RGB TTL TFT Pins / R1-R5: 11,10,9,46,3 / G0-G5: 48,47,21,14,13,12 / B1-B5: 40,39,38,0,45 / HS: 41, VS: 42, DE: 2, PCK: 1
214bmp: D:/SmartProjects/Snc/a4_bn_logo2.bmp